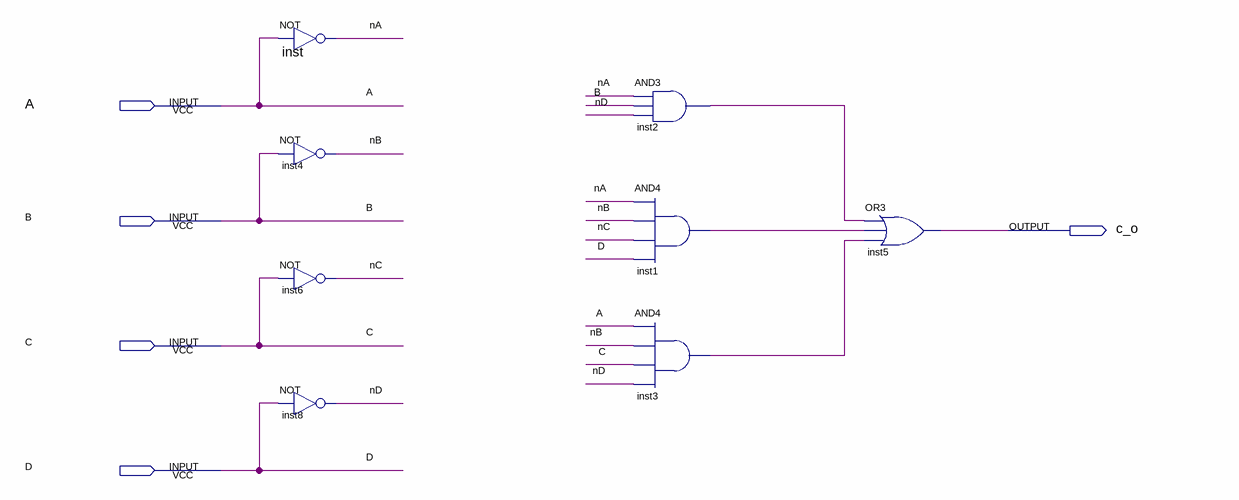
[diagram p0: schematic sheet]
// Quartus schematic c_out.bdf as structural Verilog: 8 symbols, 5 pins
module c_out (
  input  A,
  input  B,
  input  C,
  input  D,
  output c_o
);

  wire inst1_out, inst2_out, inst3_out, nA, nB, nC, nD;

  not inst (nA, A);
  not inst4 (nB, B);
  not inst6 (nC, C);
  not inst8 (nD, D);
  and inst2 (inst2_out, nA, B, nD);
  and inst1 (inst1_out, nA, nB, nC, D);
  and inst3 (inst3_out, A, nB, C, nD);
  or inst5 (c_o, inst2_out, inst1_out, inst3_out);
endmodule
